# EAGLE design 5v ac to dc (EAGLE 9.6.2)
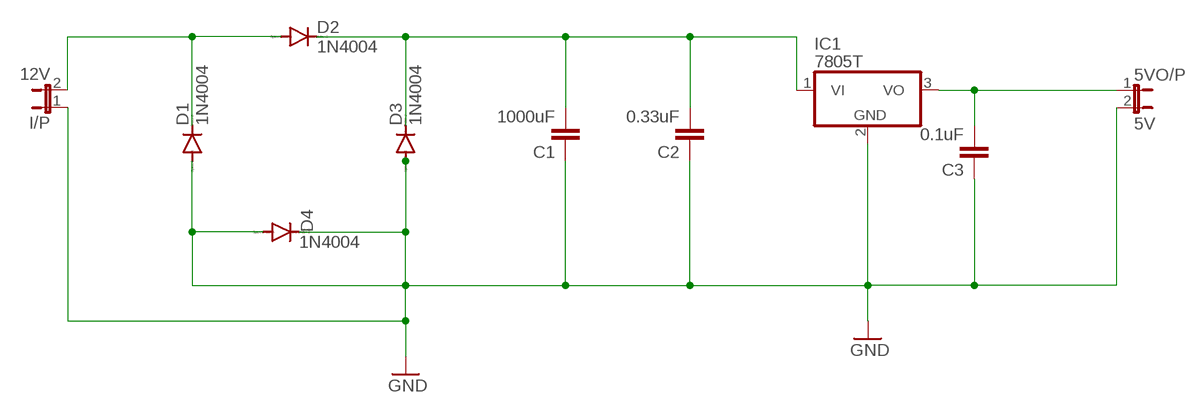
[diagram p0: schematic, sheet 1]

## Parts
5VO/P  5V  JP1E  [JP1]
C1  1000uF  C2,5-3  [C2.5-3]
C2  0.33uF  C2,5-3  [C2.5-3]
C3  0.1uF  C2,5-3  [C2.5-3]
D1  1N4004  [DO41-10]
D2  1N4004  [DO41-10]
D3  1N4004  [DO41-10]
D4  1N4004  [DO41-10]
I/P  12V  JP1E  [JP1]
IC1  7805T  [TO220H]

## Nets
GND: 5VO/P.2 C1.1 C2.1 C3.1 D1.A D3.A D4.A D4.C I/P.1 IC1.2(GND)
N$2: D1.C D2.A I/P.2
N$3: 5VO/P.1 C3.2 IC1.3(VO)
N$4: C1.2 C2.2 D2.C D3.C IC1.1(VI)

## Library data of the parts
5VO/P I/P = jumper:JP1E: JUMPER
C1-C3 = capacitor-wima:C: CAPACITOR naming: grid - package width
D1-D4 = diode:1N4004: DIODE general purpose rectifier, 1 A
IC1 = linear:78*: Positive VOLTAGE REGULATOR Source: http://cache.national.com/ds/LM/LM78L05.pdf http://www.fairchildsemi.com/ds/LM/LM7805.pdf

## Board
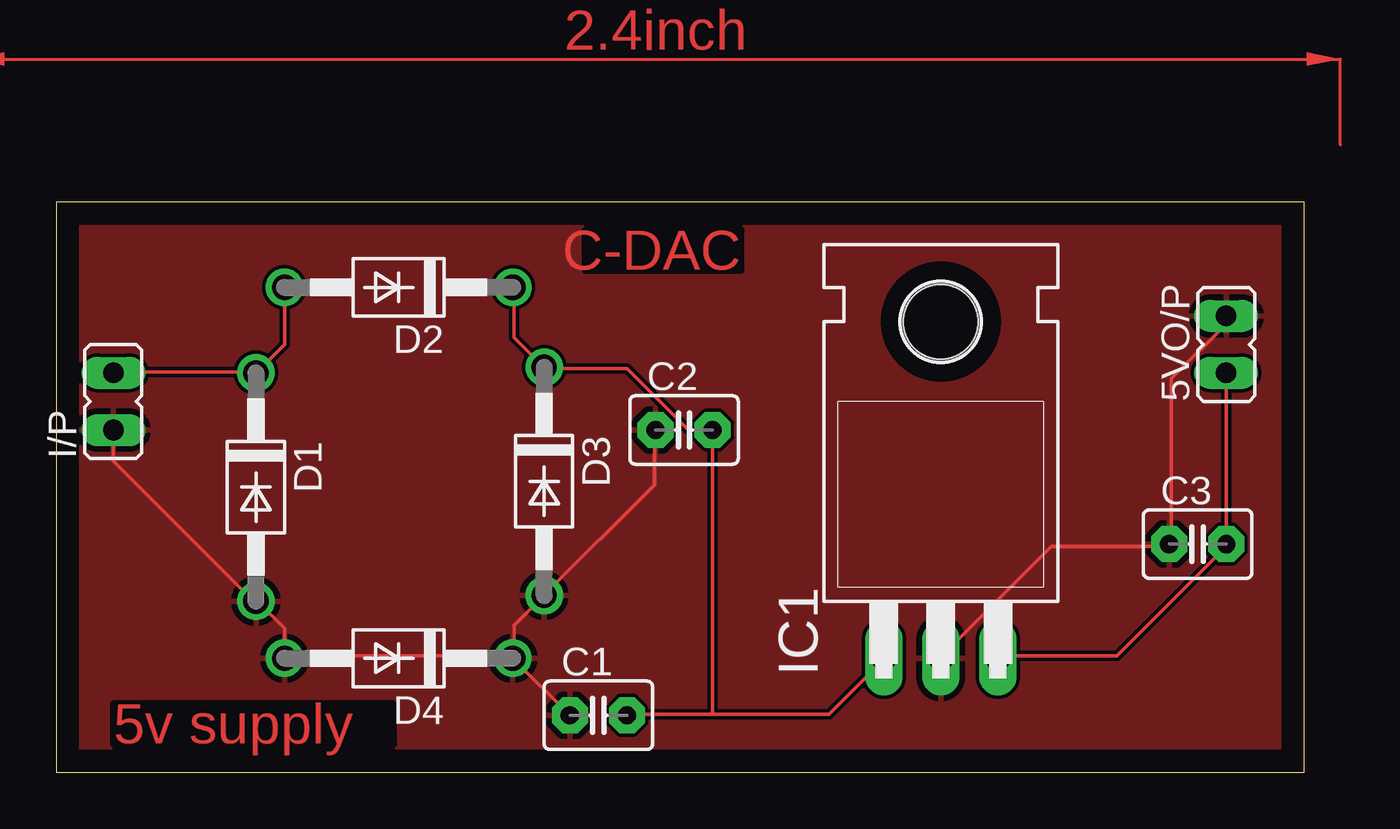
[diagram p1: board, top side]
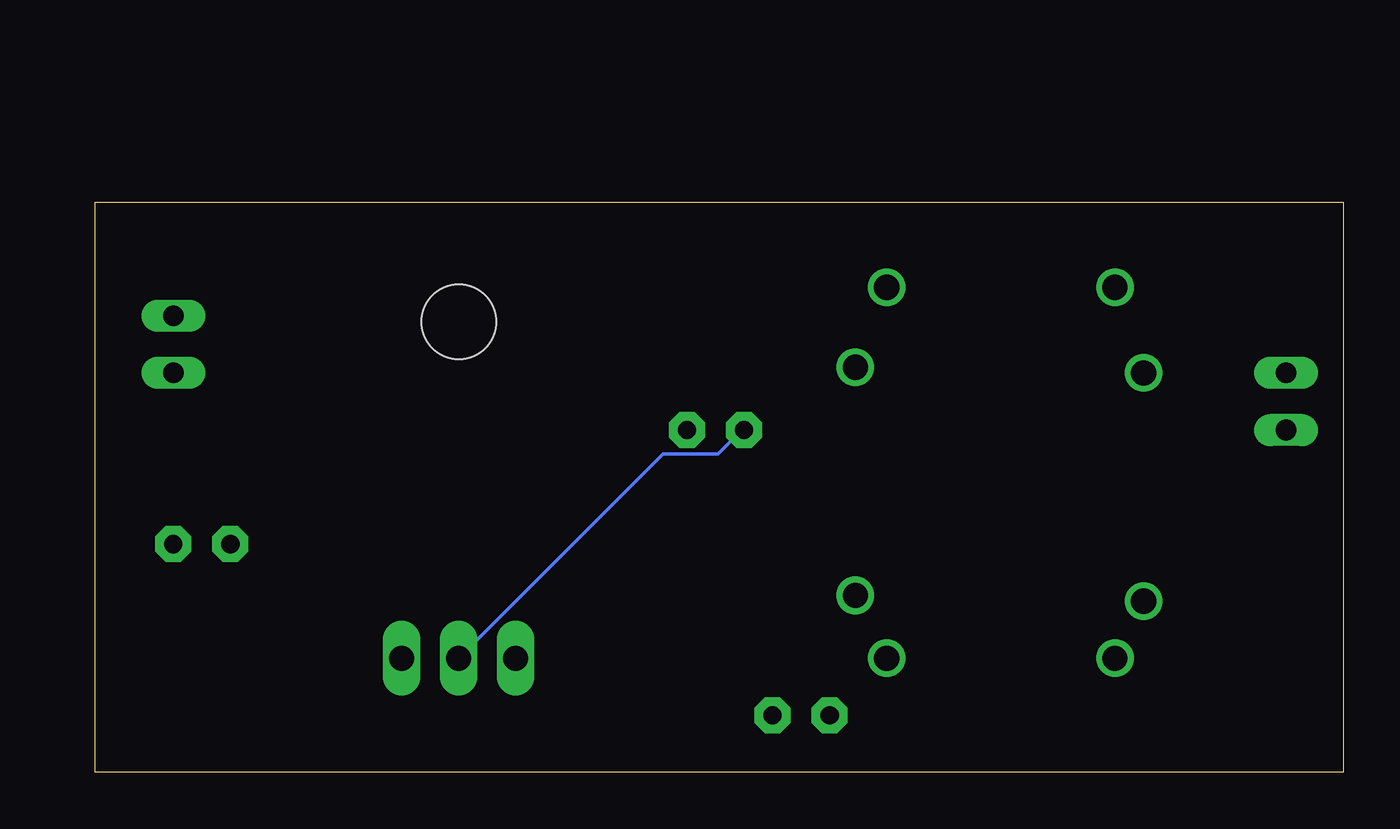
[diagram p2: board, bottom side, seen from below]

Size 55.55 x 25.39 mm. Coordinates in mm from the lower left corner, seen from the top.
Outline: 0,0 55.55,0 55.55,25.39 0,25.39 0,0
Copper layers (1*16): Top 0.035mm / dielectric 1.5mm / Bottom 0.035mm
Design rules "default": minimum track width 6mil, minimum drill 0.35mm, track to track 6mil, track to pad 6mil, pad to pad 6mil, via to via 6mil, smd to smd 6mil, copper to edge 40mil, drill to drill 6mil, minimum pad ring 10mil, minimum via ring 8mil, stop-mask expansion 4mil, vias tented up to drill 0mil, thermal gap 10mil

### Footprints (pad centres in the part's own frame; a part is rotated, then mirrored left to right if it is on the bottom)
JP1 = drill 0.914 long: 1 0,-1.27; 2 0,1.27
C2.5-3 = drill 0.813 pad 1.6 octagon: 1 -1.27,0; 2 1.27,0
DO41-10 = drill 1.118: A 5.08,0; C -5.08,0
TO220H = drill 1.118 long: 1 -2.54,-10.16; 2 0,-10.16; 3 2.54,-10.16 | hole 3.302: 0,4.826

### Placement (x,y rotation side)
5VO/P  52.07,19.05 0 top
C1  24.13,2.54 0 top
C2  27.94,15.24 0 top
C3  50.8,10.16 0 top
D1  8.89,12.7 270 top
D2  15.24,21.59 180 top
D3  21.72,12.95 270 top
D4  15.24,5.08 180 top
I/P  2.54,16.51 0 top
IC1  39.37,15.24 0 top

### Tracks (layer width: path | path; a pad name or v marks a point on that pad's centre or on a via)
GND
  Top 0.152: 5VO/P.2 52.07,19.96 49.63,17.53 49.63,10.21 C3.1 49.48,10.06 44.3,10.06 39.42,5.18 IC1.2 | I/P.1 2.54,13.87 8.79,7.62 D1.A 8.94,7.62 10.16,6.4 10.16,5.18 | D4.C C1.1 | C2.1 26.62,15.24 26.62,12.8 21.74,7.92 D3.A 21.59,7.77 20.37,6.55 20.37,5.18 D4.C | 10.16,5.18 20.22,5.18 D4.C | 10.16,5.18 D4.A
  Bottom 0.152: IC1.2 30.28,14.17 27.84,14.17 26.77,15.24 C2.1
  pour Top: -1.27,26.67 -1.27,-1.27 57.15,-1.27 57.15,26.67
N$2
  Top 0.152: I/P.2 2.54,17.83 8.79,17.83 D1.C 10.16,19.05 D2.A
N$3
  Top 0.152: 5VO/P.1 C3.2 52.07,10.06 47.19,5.18 42.01,5.18 IC1.3
N$4
  Top 0.152: 29.21,2.59 34.39,2.59 36.83,5.03 IC1.1 | 29.21,2.59 25.4,2.59 C1.2 | D2.C 20.37,21.49 20.37,19.35 21.59,18.14 D3.C 21.74,17.98 25.4,17.98 28.14,15.24 C2.2 29.21,2.59
(copper drawn outside any net)
  shapes: Top area x2

### Text on the board
Top: C-DAC | 5v supply